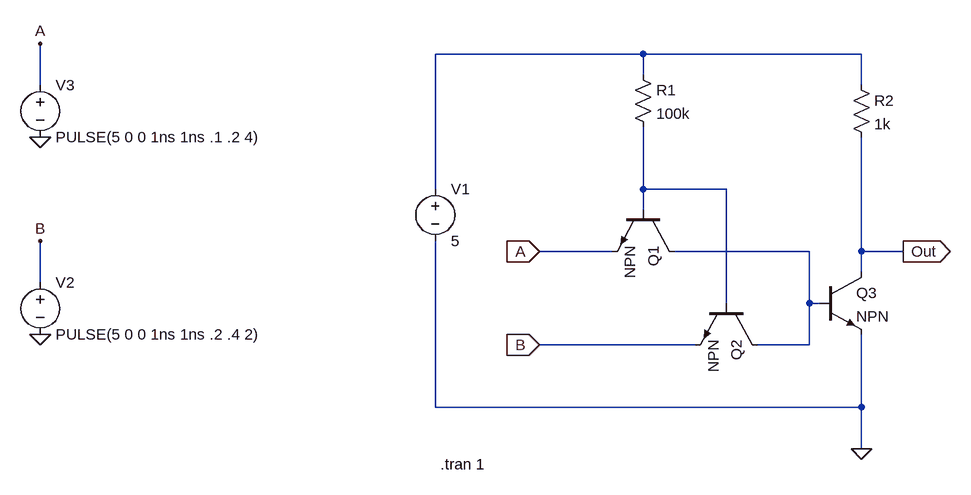
[diagram p0: schematic jm_nand.asc]
jm_nand.asc, the LTspice schematic file:
Version 4
SHEET 1 1340 680
WIRE 528 -96 208 -96
WIRE 864 -96 528 -96
WIRE 528 -64 528 -96
WIRE -400 -48 -400 -112
WIRE 864 -48 864 -96
WIRE 208 112 208 -96
WIRE 528 112 528 16
WIRE 656 112 528 112
WIRE 528 144 528 112
WIRE 480 208 368 208
WIRE 784 208 576 208
WIRE 864 208 864 32
WIRE 928 208 864 208
WIRE 864 240 864 208
WIRE -400 256 -400 192
WIRE 656 288 656 112
WIRE 784 288 784 208
WIRE 800 288 784 288
WIRE 608 352 368 352
WIRE 784 352 784 288
WIRE 784 352 704 352
WIRE 208 448 208 192
WIRE 864 448 864 336
WIRE 864 448 208 448
WIRE 864 512 864 448
FLAG 368 208 A
IOPIN 368 208 In
FLAG 368 352 B
IOPIN 368 352 In
FLAG 864 512 0
FLAG -400 32 0
FLAG -400 336 0
FLAG -400 -112 A
FLAG -400 192 B
FLAG 928 208 Out
IOPIN 928 208 Out
SYMBOL voltage 208 96 R0
WINDOW 123 0 0 Left 0
WINDOW 39 0 0 Left 0
SYMATTR InstName V1
SYMATTR Value 5
SYMBOL npn 576 144 R90
SYMATTR InstName Q1
SYMBOL npn 704 288 R90
SYMATTR InstName Q2
SYMBOL npn 800 240 R0
SYMATTR InstName Q3
SYMBOL res 512 -80 R0
SYMATTR InstName R1
SYMATTR Value 100k
SYMBOL res 848 -64 R0
SYMATTR InstName R2
SYMATTR Value 1k
SYMBOL voltage -400 240 R0
WINDOW 123 0 0 Left 0
WINDOW 39 0 0 Left 0
SYMATTR InstName V2
SYMATTR Value PULSE(5 0 0 1ns 1ns .2 .4 2)
SYMBOL voltage -400 -64 R0
WINDOW 123 0 0 Left 0
WINDOW 39 0 0 Left 0
SYMATTR InstName V3
SYMATTR Value PULSE(5 0 0 1ns 1ns .1 .2 4)
TEXT 216 536 Left 2 !.tran 1

The netlist it stands for:
* jm_nand.asc
V1 N001 0 5
Q1 N003 N002 A 0 NPN
Q2 N003 N002 B 0 NPN
Q3 Out N003 0 0 NPN
R1 N001 N002 100k
R2 N001 Out 1k
V2 B 0 PULSE(5 0 0 1ns 1ns .2 .4 2)
V3 A 0 PULSE(5 0 0 1ns 1ns .1 .2 4)
.model NPN NPN
.model PNP PNP
.lib standard.bjt
.tran 1
.backanno
.end